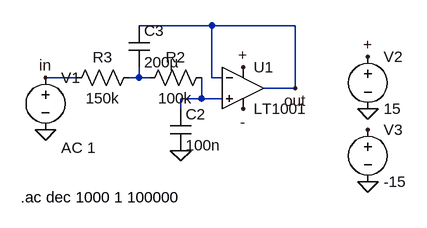
[diagram p0: schematic ChebyshevFilter_402101577.asc]
ChebyshevFilter_402101577.asc, the LTspice schematic file:
Version 4
SHEET 1 880 680
WIRE 176 64 64 64
WIRE 304 64 176 64
WIRE -32 144 -80 144
WIRE 64 144 64 128
WIRE 64 144 48 144
WIRE 80 144 64 144
WIRE 176 144 176 64
WIRE 192 144 176 144
WIRE 304 160 304 64
WIRE 304 160 256 160
WIRE 160 176 160 144
WIRE 160 176 128 176
WIRE 192 176 160 176
WIRE 128 192 128 176
FLAG 128 256 0
FLAG -80 224 0
FLAG 416 112 +
FLAG 224 128 +
FLAG 416 224 -
FLAG 224 192 -
FLAG 416 192 0
FLAG 416 304 0
FLAG -80 144 in
FLAG 304 160 out
SYMBOL OpAmps\\LT1001 224 96 R0
SYMATTR InstName U1
SYMBOL cap 112 192 R0
SYMATTR InstName C2
SYMATTR Value 100n
SYMBOL cap 48 64 R0
SYMATTR InstName C3
SYMATTR Value 200µ
SYMBOL res 176 128 R90
WINDOW 0 0 56 VBottom 2
WINDOW 3 32 56 VTop 2
SYMATTR InstName R2
SYMATTR Value 100k
SYMBOL res 64 128 R90
WINDOW 0 0 56 VBottom 2
WINDOW 3 32 56 VTop 2
SYMATTR InstName R3
SYMATTR Value 150k
SYMBOL voltage -80 128 R0
WINDOW 123 24 124 Left 2
WINDOW 39 0 0 Left 0
SYMATTR InstName V1
SYMATTR Value ""
SYMATTR Value2 AC 1
SYMBOL voltage 416 96 R0
WINDOW 123 0 0 Left 0
WINDOW 39 0 0 Left 0
SYMATTR InstName V2
SYMATTR Value 15
SYMBOL voltage 416 208 R0
WINDOW 123 0 0 Left 0
WINDOW 39 0 0 Left 0
SYMATTR InstName V3
SYMATTR Value -15
TEXT -118 328 Left 2 !.ac dec 1000 1 100000

The netlist it stands for:
* ChebyshevFilter_402101577.asc
XU1 N002 out + - out LT1001  ; pins In+ In- V+ V- OUT
C2 N002 0 100n
C3 out N001 200µ
R2 N002 N001 100k
R3 N001 in 150k
V1 in 0 AC 1
V2 + 0 15
V3 - 0 -15
.ac dec 1000 1 100000
.lib LTC.lib
.backanno
.end